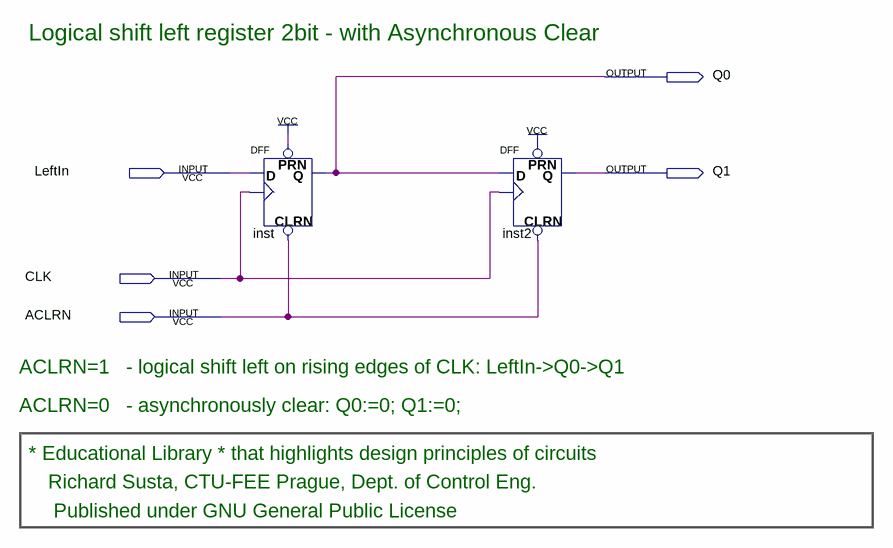
[diagram p0: schematic sheet]
// Quartus schematic shift2.bdf as structural Verilog: 2 symbols, 5 pins
module shift2 (
  input  LeftIn,
  input  CLK,
  input  ACLRN,
  output Q0,
  output Q1
);

  DFF inst (.CLRN(ACLRN), .CLK(CLK), .D(LeftIn), .PRN(1'b1), .Q(Q0));
  DFF inst2 (.CLRN(ACLRN), .CLK(CLK), .D(Q0), .PRN(1'b1), .Q(Q1));

  // Notes on the sheet:
  //   Logical shift left register 2bit - with Asynchronous Clear
  //   ACLRN=1   - logical shift left on rising edges of CLK: LeftIn->Q0->Q1
  //   ACLRN=0   - asynchronously clear: Q0:=0; Q1:=0;
  //   * Educational Library * that highlights design principles of circuits
  //   Richard Susta, CTU-FEE Prague, Dept. of Control Eng. 
  //    Published under GNU General Public License
endmodule
